# EAGLE design ShutterControl (EAGLE 5.11)
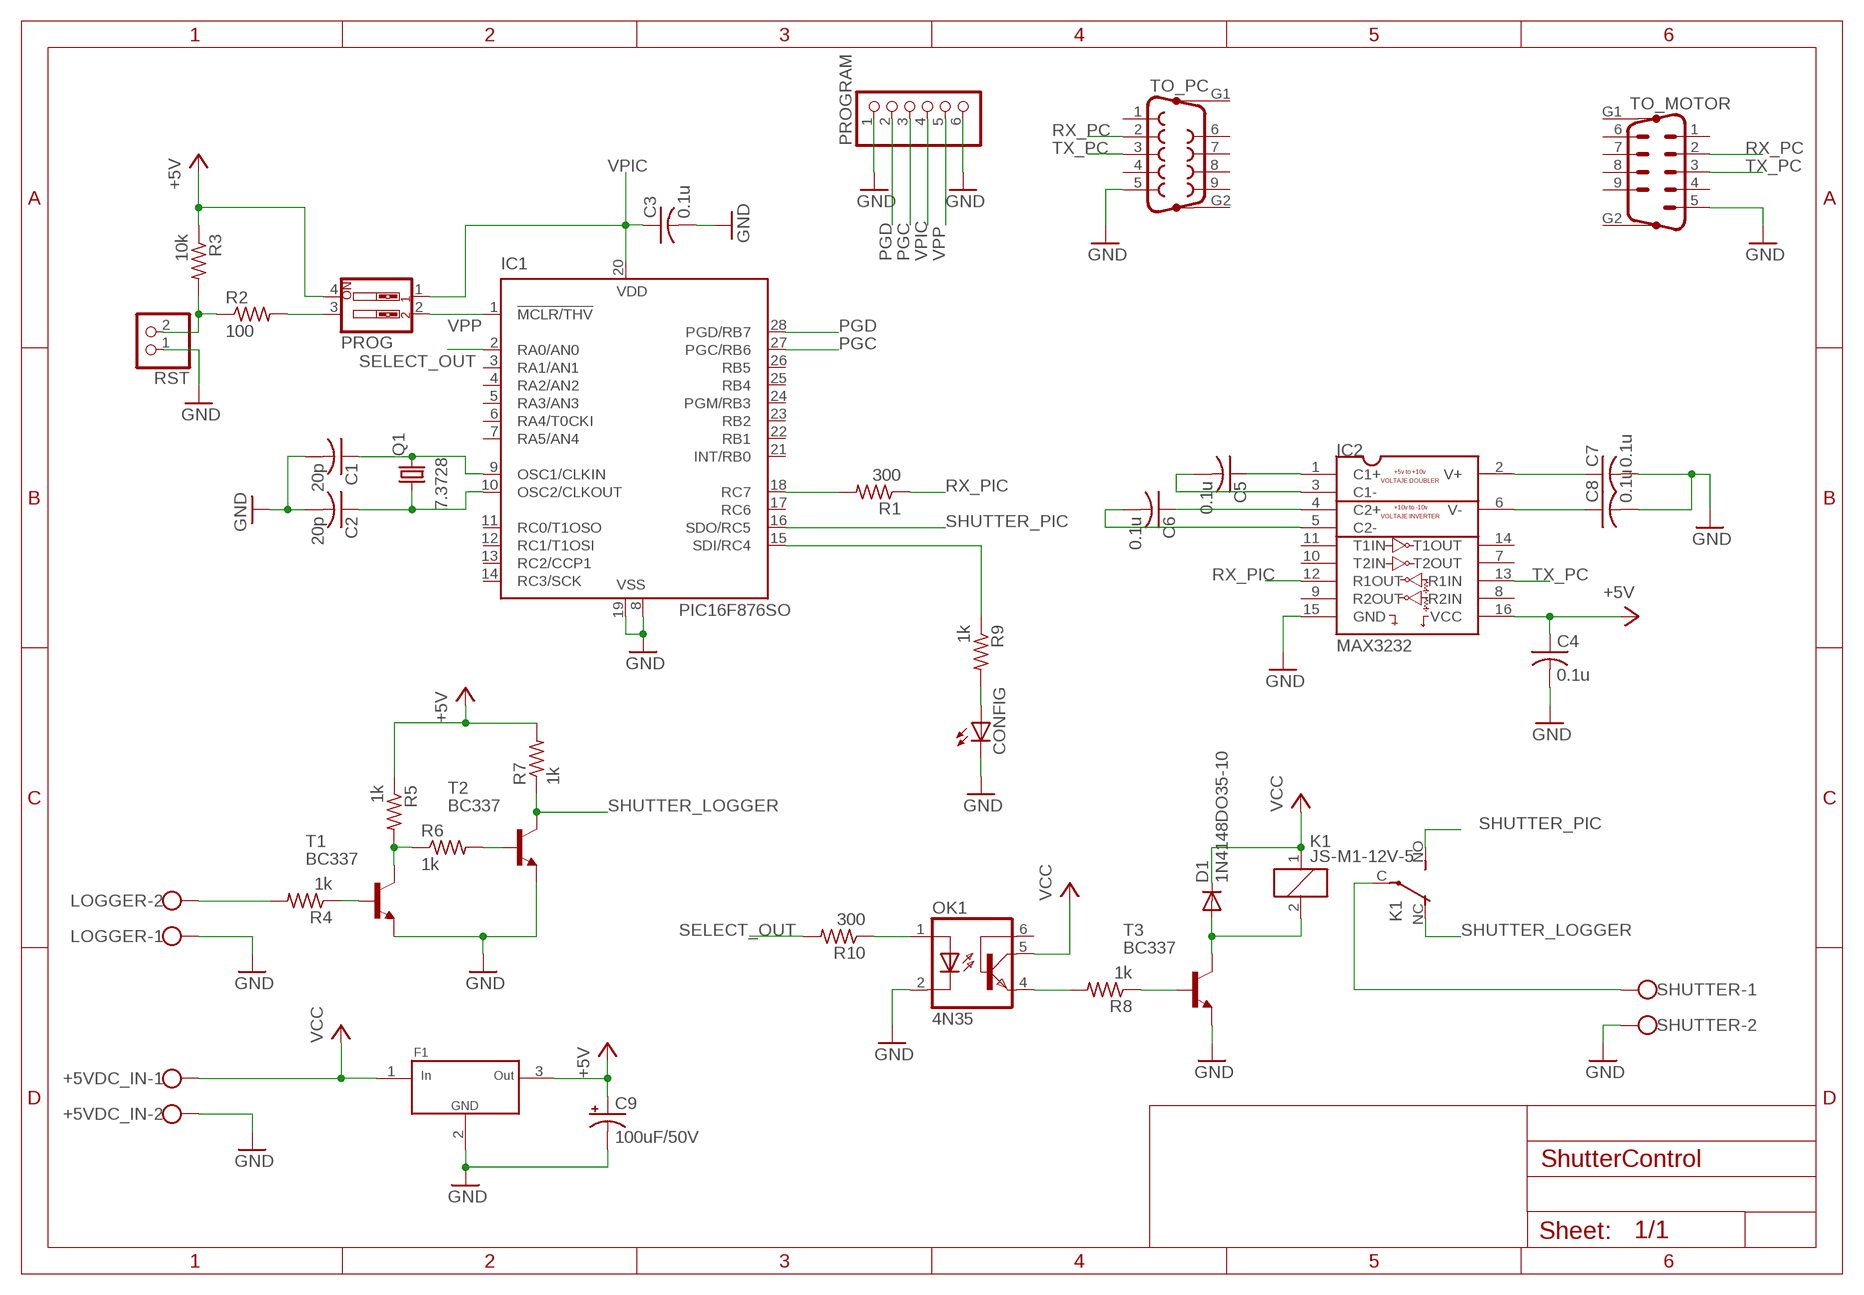
[diagram p0: schematic, sheet 1]

## Parts
+5VDC_IN  W237-102  [W237-102]
C1  20p  C-USC0603  [C0603]
C2  20p  C-USC0603  [C0603]
C3  0.1u  C-USC0603  [C0603]
C4  0.1u  C-USC0603  [C0603]
C5  0.1u  C-USC0603  [C0603]
C6  0.1u  C-USC0603  [C0603]
C7  0.1u  C-USC0603  [C0603]
C8  0.1u  C-USC0603  [C0603]
C9  100uF/50V  CPOL-USE3.5-8  [E3,5-8]
CONFIG  LED3MM  [LED3MM]
D1  1N4148DO35-10  [DO35-10]
F1  EMIFIL  [NFE-2706]
IC1  PIC16F876SO  [SO28W]
IC2  MAX3232  MAX3232IDR  [SO16]
K1  JS-M1-12V-5  [JS-M]
LOGGER  W237-102  [W237-102]
OK1  4N35  [DIL06]
PROG  SW_DIP-2  [EDG-02]
PROGRAM  PINHD-1X6  [1X06]
Q1  7.3728  CRYSTALHC49U70  [HC49U70]
R1  300  R-US_R0603  [R0603]
R2  100  R-US_R0603  [R0603]
R3  10k  R-US_R0603  [R0603]
R4  1k  R-US_R0603  [R0603]
R5  1k  R-US_R0603  [R0603]
R6  1k  R-US_R0603  [R0603]
R7  1k  R-US_R0603  [R0603]
R8  1k  R-US_R0603  [R0603]
R9  1k  R-US_R0603  [R0603]
R10  300  R-US_R0603  [R0603]
RST  PINHD-1X2  [1X02]
SHUTTER  W237-102  [W237-102]
T1  BC337  [TO92]
T2  BC337  [TO92]
T3  BC337  [TO92]
TO_MOTOR  M09HP  [M09HP]
TO_PC  F09HP  [F09HP]

## Nets
+5V: C4.1 C9.+ F1.3 IC2.16(VCC) PROG.4 R3.1 R5.1 R7.2
GND: +5VDC_IN.2 C1.2 C2.2 C3.2 C4.2 C7.2 C8.2 C9.- CONFIG.K(C) F1.2 IC1.8(VSS) IC1.19(VSS) IC2.15(GND) LOGGER.1 OK1.2(C) PROGRAM.1 PROGRAM.6 RST.1 SHUTTER.2 T1.1(E) T2.1(E) T3.1(E) TO_MOTOR.5 TO_PC.5
N$1: C1.1 IC1.9(OSC1/CLKIN) Q1.2
N$2: C2.1 IC1.10(OSC2/CLKOUT) Q1.1
N$3: C7.1 IC2.2(V+)
N$4: R2.1 R3.2 RST.2
N$5: PROG.3 R2.2
N$6: C8.1 IC2.6(V-)
N$7: C5.1 IC2.1(C1+)
N$8: C5.2 IC2.3(C1-)
N$9: C6.1 IC2.4(C2+)
N$10: C6.2 IC2.5(C2-)
N$11: R5.2 R6.1 T1.3(C)
N$12: R6.2 T2.2(B)
N$13: IC1.18(RC7) R1.2
N$14: CONFIG.A R9.2
N$15: R4.1 T1.2(B)
N$16: OK1.4(EMI) R8.2
N$17: D1.A K1.2 T3.3(C)
N$18: OK1.1(A) R10.1
N$19: R8.1 T3.2(B)
N$20: K1.C(2:P) SHUTTER.1
N$25: LOGGER.2 R4.2
N$26: IC1.15(SDI/RC4) R9.1
PGC: IC1.27(PGC/RB6) PROGRAM.3
PGD: IC1.28(PGD/RB7) PROGRAM.2
RX_PC: TO_MOTOR.2 TO_PC.2
RX_PIC: IC2.12(R1OUT) R1.1
SELECT_OUT: IC1.2(RA0/AN0) R10.2
SHUTTER_LOGGER: K1.NC(2:O) R7.1 T2.3(C)
SHUTTER_PIC: IC1.16(SDO/RC5) K1.NO(2:S)
TX_PC: IC2.13(R1IN) TO_MOTOR.3 TO_PC.3
VCC: +5VDC_IN.1 D1.C F1.1 K1.1 OK1.5(COL)
VPIC: C3.1 IC1.20(VDD) PROG.1 PROGRAM.4
VPP: IC1.1(!MCLR/THV) PROG.2 PROGRAM.5
Unconnected: IC1.3(RA1/AN1) IC1.4(RA2/AN2) IC1.5(RA3/AN3) IC1.6(RA4/T0CKI) IC1.7(RA5/AN4) IC1.11(RC0/T1OSO) IC1.12(RC1/T1OSI) IC1.13(RC2/CCP1) IC1.14(RC3/SCK) IC1.17(RC6) IC1.21(INT/RB0) IC1.22(RB1) IC1.23(RB2) IC1.24(PGM/RB3) IC1.25(RB4) IC1.26(RB5) IC2.7(T2OUT) IC2.8(R2IN) IC2.9(R2OUT) IC2.10(T2IN) IC2.11(T1IN) IC2.14(T1OUT) OK1.6(BAS) TO_MOTOR.1 TO_MOTOR.4 TO_MOTOR.6 TO_MOTOR.7 TO_MOTOR.8 TO_MOTOR.9 TO_MOTOR.G1 TO_MOTOR.G2 TO_PC.1 TO_PC.4 TO_PC.6 TO_PC.7 TO_PC.8 TO_PC.9 TO_PC.G1 TO_PC.G2

## Library data of the parts
+5VDC_IN LOGGER SHUTTER = con-wago-500:W237-102: WAGO SCREW CLAMP; MPN: 237-102; OC_FARNELL: unknown; OC_NEWARK: 70K9898
C1-C8 = rcl:C-US: CAPACITOR, American symbol
C9 = rcl:CPOL-US: POLARIZED CAPACITOR, American symbol
CONFIG = led:LED: LED OSRAM: - CHIPLED LG R971, LG N971, LY N971, LG Q971, LY Q971, LO R971, LY R971 LH N974, LH R974 LS Q976, LO Q976, LY Q976 LO Q996 - Hyper CHIPLED LW Q18S LB Q993, LB Q99A, LB R99A - SideLED LS A670, LO A670, LY A670, LG A670, LP A670 LB A673, LV A673, LT A673, LW A673 LH A674 LY A675 LS A676, LA A676, LO A676, LY A676, LW A676 LS A679, LY A679, LG A679 - Hyper Micro SIDELED® LS Y876, LA Y876, LO Y876, LY Y876 LT Y87S - SmartLED LW L88C, LW L88S LB L89C, LB L89S, LG L890 LS L89K, LO L89K, LY L89K LS L896, LA L896, LO L896, LY L896 - TOPLED LS T670, LO T670, LY T670, LG T670, LP T670 LSG T670, LSP T670, LSY T670, LOP T670, LYG T670 LG T671, LOG T671, LSG T671 LB T673, LV T673, LT T673, LW T673 LH T674 LS T676, LA T676, LO T676, LY T676, LB T676, LH T676, LSB T676, LW T676 LB T67C, LV T67C, LT T67C, LS T67K, LO T67K, LY T67K, LW E67C LS E67B, LA E67B, LO E67B, LY E67B, LB E67C, LV E67C, LT E67C LW T67C LS T679, LY T679, LG T679 LS T770, LO T770, LY T770, LG T770, LP T770 LB T773, LV T773, LT T773, LW T773 LH T774 LS E675, LA E675, LY E675, LS T675 LS T776, LA T776, LO T776, LY T776, LB T776 LHGB T686 LT T68C, LB T68C - Hyper Mini TOPLED® LB M676 - Mini TOPLED Santana® LG M470 LS M47K, LO M47K, LY M47K Source: http://www.osram.convergy.de LUXEON: - LUMILED® LXK2-PW12-R00, LXK2-PW12-S00, LXK2-PW14-U00, LXK2-PW14-V00 LXK2-PM12-R00, LXK2-PM12-S00, LXK2-PM14-U00 LXK2-PE12-Q00, LXK2-PE12-R00, LXK2-PE12-S00, LXK2-PE14-T00, LXK2-PE14-U00 LXK2-PB12-K00, LXK2-PB12-L00, LXK2-PB12-M00, LXK2-PB14-N00, LXK2-PB14-P00, LXK2-PB14-Q00 LXK2-PR12-L00, LXK2-PR12-M00, LXK2-PR14-Q00, LXK2-PR14-R00 LXK2-PD12-Q00, LXK2-PD12-R00, LXK2-PD12-S00 LXK2-PH12-R00, LXK2-PH12-S00 LXK2-PL12-P00, LXK2-PL12-Q00, LXK2-PL12-R00 Source: www.luxeon.com KINGBRIGHT: KA-3528ASYC Source: www.kingbright.com
D1 = diode:1N4148: DIODE high speed (Philips)
F1 = magnetometro:EMIFIL
IC1 = microchip:PIC16*876: MICROCONTROLLER flash type; MF: MICROCHIP; MPN: PIC16F876-20/SO; OC_FARNELL: 9761268; OC_NEWARK: 12C1950
IC2 = LibraryMagnet:MAX3232IDR
K1 = relay:JS-M1*: Automotive Ultra-Miniature Power Relay NAiS Source: http://www.mew-europe.com/.. en_ds_61211_0000.pdf; MF: FARNELL; MPN: JSM1-12V-5; OC_FARNELL: 910351; OC_NEWARK: 14J1764
OK1 = optocoupler:4N35: MOTOROLA OPTO COUPLER; MF: FAIRCHILD SEMICONDUCTOR; MPN: 4N35; OC_FARNELL: 1328375; OC_NEWARK: 72K9946
PROG = special:SW_DIP-2: DIP SWITCH
PROGRAM = pinhead:PINHD-1X6: PIN HEADER
Q1 = crystal:CRYSTAL: CRYSTAL; OC_FARNELL: unknown; OC_NEWARK: unknown
R1-R10 = rcl:R-US_: RESISTOR, American symbol
RST = pinhead:PINHD-1X2: PIN HEADER
T1-T3 = transistor:BC337: NPN TRANSISTOR
TO_MOTOR = con-subd:M09HP: SUB-D; OC_FARNELL: unknown; OC_NEWARK: unknown
TO_PC = con-subd:F09HP: SUB-D; OC_FARNELL: unknown; OC_NEWARK: unknown

## Board
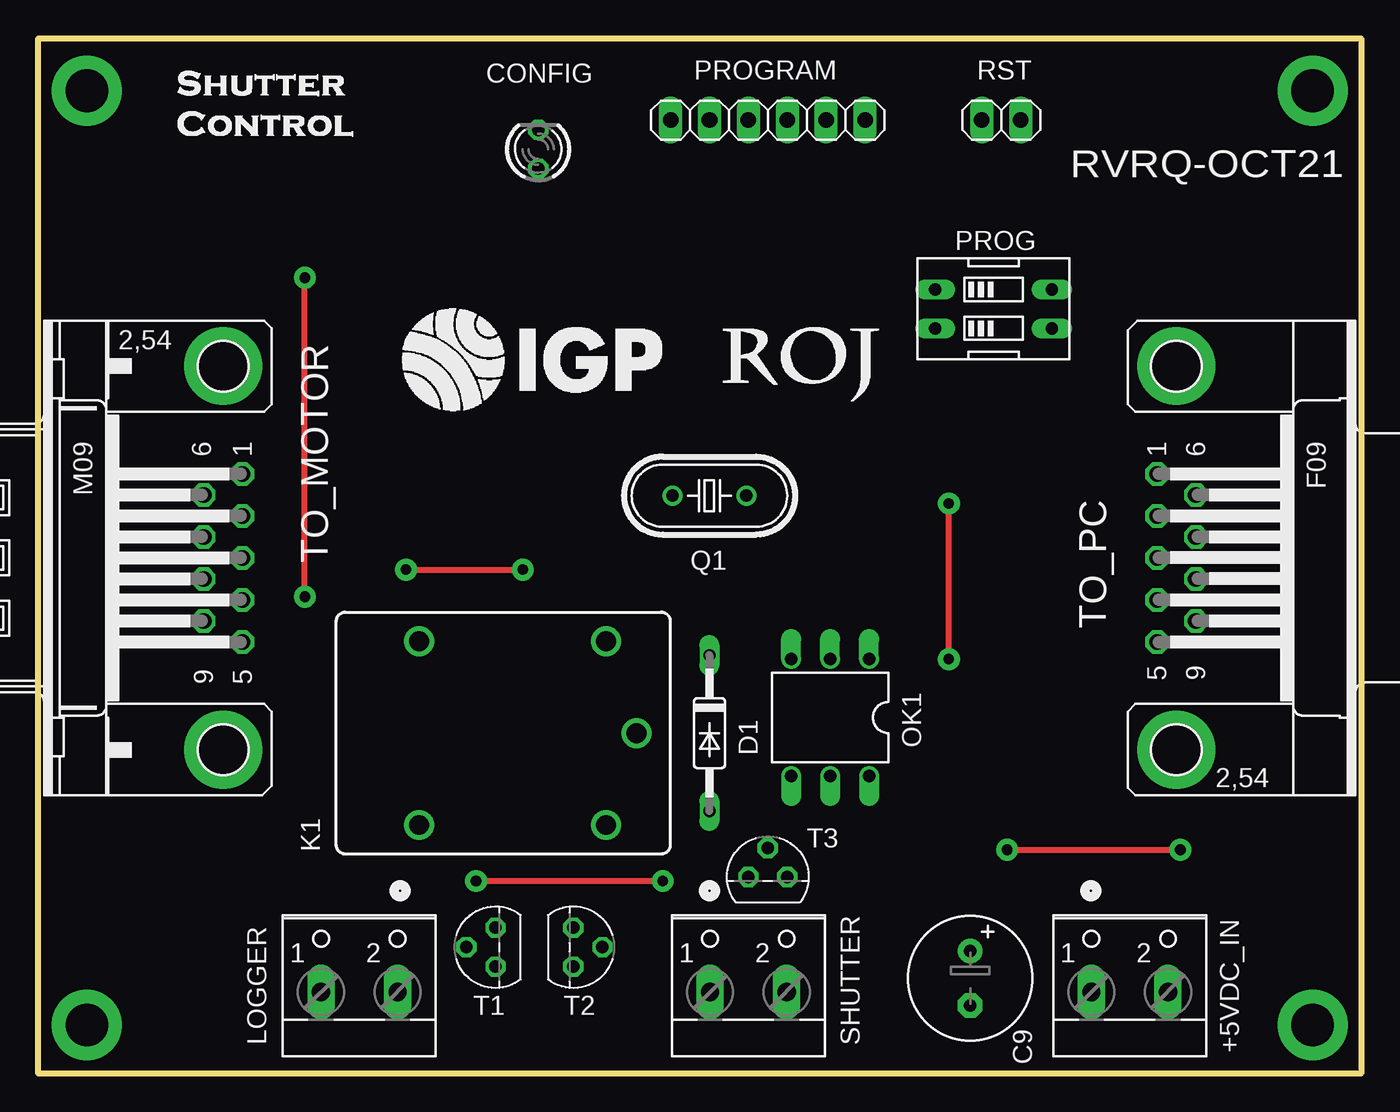
[diagram p1: board, top side]
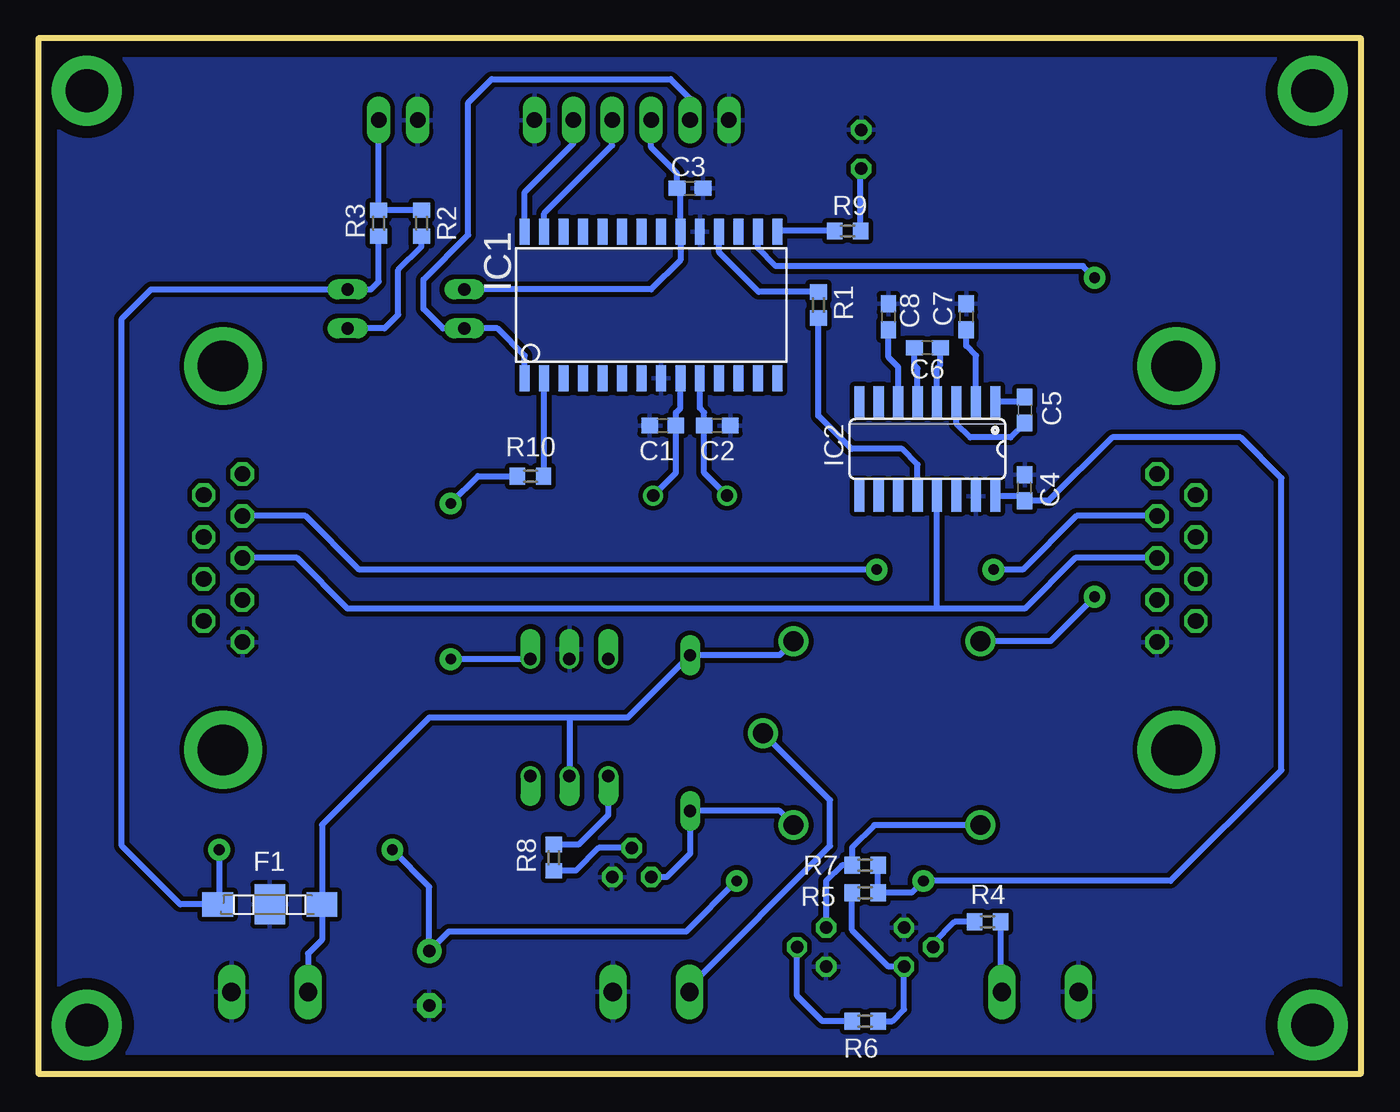
[diagram p2: board, bottom side, seen from below]

Size 86.36 x 67.56 mm. Coordinates in mm from the lower left corner, seen from the top.
Outline: 0,0 0,67.56 86.36,67.56 86.36,0 0,0
Copper layers (1*16): Top 0.035mm / dielectric 1.5mm / Bottom 0.035mm
Design rules "default": minimum track width 10mil, minimum drill 24mil, track to track 8mil, track to pad 8mil, pad to pad 8mil, via to via 8mil, smd to smd 8mil, copper to edge 40mil, drill to drill 8mil, minimum pad ring 10mil, minimum via ring 8mil, stop-mask expansion 4mil, vias tented up to drill 0mil, thermal gap 10mil
bRestrict: area 0.6,61.6 to 5.7,66.7; area 0.6,0.6 to 5.7,5.7; area 80.6,0.6 to 85.7,5.7; area 80.6,61.6 to 85.7,66.7

### Footprints (pad centres in the part's own frame; a part is rotated, then mirrored left to right if it is on the bottom)
W237-102 = drill 1.194 long: 1 -2.5,-0.381; 2 2.5,-0.381
C0603 = smd 1.1 x 1: 1 -0.85,0; 2 0.85,0
E3,5-8 = drill 0.813 pad 1.6 round: + -1.778,0 | drill 0.813 pad 1.6 octagon: - 1.778,0
LED3MM = drill 0.813 octagon: A -1.27,0; K 1.27,0
DO35-10 = drill 0.813 long: A 5.08,0; C -5.08,0
NFE-2706 = smd 2 x 1.6: 1 -3.4,0; 3 3.4,0 | smd 2 x 2.6: 2 0,0
SO28W = smd 0.65 x 1.7: 1 -8.255,-4.78; 2 -6.985,-4.78; 3 -5.715,-4.78; 4 -4.445,-4.78; 5 -3.175,-4.78; 6 -1.905,-4.78; 7 -0.635,-4.78; 8 0.635,-4.78; 9 1.905,-4.78; 10 3.175,-4.78; 11 4.445,-4.78; 12 5.715,-4.78; 13 6.985,-4.78; 14 8.255,-4.78; 15 8.255,4.78; 16 6.985,4.78; 17 5.715,4.78; 18 4.445,4.78; 19 3.175,4.78; 20 1.905,4.78; 21 0.635,4.78; 22 -0.635,4.78; 23 -1.905,4.78; 24 -3.175,4.78; 25 -4.445,4.78; 26 -5.715,4.78; 27 -6.985,4.78; 28 -8.255,4.78
SO16 = smd 0.66 x 2.032: 1 -4.445,-3.073; 2 -3.175,-3.073; 3 -1.905,-3.073; 4 -0.635,-3.073; 5 0.635,-3.073; 6 1.905,-3.073; 7 3.175,-3.073; 8 4.445,-3.073; 9 4.445,3.073; 10 3.175,3.073; 11 1.905,3.073; 12 0.635,3.073; 13 -0.635,3.073; 14 -1.905,3.073; 15 -3.175,3.073; 16 -4.445,3.073
JS-M = drill 1.3 round: 1 6.7,6; 2 6.7,-6; C 8.7,0; NC -5.5,-6; NO -5.5,6
DIL06 = drill 0.813 offset: 1 -2.54,-3.81; 2 0,-3.81; 3 2.54,-3.81; 4 2.54,3.81; 5 0,3.81; 6 -2.54,3.81
EDG-02 = drill 0.813 long: 1 -1.27,-3.81; 2 1.27,-3.81; 3 1.27,3.81; 4 -1.27,3.81
1X06 = drill 1.016 long: 1 -6.35,0; 2 -3.81,0; 3 -1.27,0; 4 1.27,0; 5 3.81,0; 6 6.35,0
HC49U70 = drill 0.813 round: 1 -2.413,0; 2 2.413,0
R0603 = smd 1 x 1.1: 1 -0.85,0; 2 0.85,0
1X02 = drill 1.016 long: 1 -1.27,0; 2 1.27,0
TO92 = drill 0.813 octagon: 1 1.27,0; 2 0,1.905; 3 -1.27,0
M09HP = drill 1.016 octagon: 1 -5.486,1.27; 2 -2.743,1.27; 3 0,1.27; 4 2.743,1.27; 5 5.486,1.27; 6 -4.115,-1.27; 7 -1.372,-1.27; 8 1.372,-1.27; 9 4.115,-1.27 | drill 3.302 pad 5.08 round: G1 -12.522,0; G2 12.522,0
F09HP = drill 1.016 octagon: 1 -5.486,-1.27; 2 -2.743,-1.27; 3 0,-1.27; 4 2.743,-1.27; 5 5.486,-1.27; 6 -4.115,1.27; 7 -1.372,1.27; 8 1.372,1.27; 9 4.115,1.27 | drill 3.302 pad 5.08 round: G1 -12.522,0; G2 12.522,0

### Placement (x,y rotation side)
+5VDC_IN  71.25,5.71 0 top
C1  45.59,42.29 180 bottom
C2  42.04,42.29 0 bottom
C3  43.82,57.79 0 bottom
C4  21.97,38.23 90 bottom
C5  21.97,43.31 270 bottom
C6  28.32,47.37 180 bottom
C7  25.78,49.4 90 bottom
C8  30.86,49.4 90 bottom
C9  60.83,6.22 270 top
CONFIG  32.64,60.33 90 top
D1  43.82,22.22 270 top
F1  71.25,11.05 180 bottom
IC1  46.36,50.16 0 bottom
IC2  28.32,40.77 180 bottom
K1  30.35,22.22 0 top
LOGGER  20.95,5.71 0 top
OK1  51.69,23.24 180 top
PROG  62.36,49.91 270 top
PROGRAM  47.62,62.23 180 top
Q1  43.82,37.72 0 top
R1  35.43,50.16 90 bottom
R2  61.34,55.5 270 bottom
R3  64.13,55.5 90 bottom
R4  24.38,9.91 0 bottom
R5  32.39,11.81 180 bottom
R6  32.39,3.43 180 bottom
R7  32.39,13.59 0 bottom
R8  52.71,14.1 90 bottom
R9  33.53,54.99 0 bottom
R10  54.23,38.99 0 bottom
RST  62.87,62.23 0 top
SHUTTER  46.36,5.71 0 top
T1  29.84,8.26 90 top
T2  34.93,8.26 270 top
T3  47.62,12.83 0 top
TO_MOTOR  12.06,33.66 270 top
TO_PC  74.3,33.66 270 top

### Tracks (layer width: path | path; a pad name or v marks a point on that pad's centre or on a via)
+5V  (via drill 0.7 pad 1.42)
  Top 0.406: v28.57,12.57 v40.77,12.57 | v63.25,14.61 v74.55,14.61
  Bottom 0.406: R7.2 R5.1 29.34,11.81 v28.57,12.57 12.45,12.57 5.21,19.81 5.21,38.86 7.87,41.53 16.26,41.53 20.41,37.38 C4.1 22.29,37.69 IC2.16 | v40.77,12.57 44.07,9.27 59.56,9.27 C9.+ 60.83,12.19 v63.25,14.61 | R3.1 64.13,51.69 64.64,51.18 PROG.4 78.99,51.18 80.9,49.28 80.9,14.86 77.09,11.05 F1.3 74.55,11.15 v74.55,14.61
GND
  pour Bottom (isolate 0.305): 0,67.56 87.5,67.56 87.5,-0.25 0,-0.25
N$1
  Bottom 0.406: IC1.9 44.45,43.43 44.74,43.14 C1.1 44.74,39.2 Q1.2
N$2
  Bottom 0.406: IC1.10 43.18,43.43 42.89,43.14 C2.1 42.89,39.2 Q1.1
N$3
  Bottom 0.406: IC2.2 25.15,46.86 25.78,47.5 C7.1
N$4
  Bottom 0.406: RST.2 R3.2 R2.1
N$5
  Bottom 0.406: PROG.3 63.75,48.64 62.87,49.53 62.87,52.45 61.34,53.98 R2.2
N$6
  Bottom 0.406: IC2.6 30.23,46.1 30.86,46.74 C8.1
N$7
  Bottom 0.406: C5.1 22.29,43.84 IC2.1
N$8
  Bottom 0.406: C5.2 22.9,41.53 25.53,41.53 26.42,42.42 IC2.3
N$9
  Bottom 0.406: IC2.4 27.69,46.02 27.47,46.24 C6.1
N$10
  Bottom 0.406: IC2.5 28.96,46.02 29.17,46.24 C6.2
N$11
  Bottom 0.406: R6.1 30.61,3.43 29.84,4.19 T1.3 30.86,6.99 33.23,9.36 R5.2
N$12
  Bottom 0.406: R6.2 35.18,3.43 36.83,5.08 T2.2
N$13
  Bottom 0.406: R1.2 39.33,51.02 41.91,53.59 IC1.18
N$14
  Bottom 0.406: R9.2 32.68,59.02 CONFIG.A
N$15
  Bottom 0.406: R4.1 26.54,9.91 27.94,8.51 T1.2
N$16
  Bottom 0.406: OK1.4 49.15,16.89 51.09,14.95 R8.2
N$17
  Bottom 0.406: T3.3 45.34,12.83 43.82,14.35 D1.A 37.97,17.14 K1.2
N$18  (via drill 0.7 pad 1.42)
  Top 0.406: v59.44,27.05 v59.44,37.21
  Bottom 0.406: R10.1 57.66,38.99 v59.44,37.21 | OK1.1 v59.44,27.05
N$19
  Bottom 0.406: T3.2 49.78,14.73 51.27,13.25 R8.1
N$20
  Bottom 0.406: K1.C 34.67,17.84 34.67,14.86 43.86,5.67 SHUTTER.1
N$21  (via drill 2.8 pad 4.57)
  other vias: 3.17,64.13
N$22  (via drill 2.8 pad 4.57)
  other vias: 83.18,64.13
N$23  (via drill 2.8 pad 4.57)
  other vias: 83.18,3.17
N$24  (via drill 2.8 pad 4.57)
  other vias: 3.17,3.17
N$25
  Bottom 0.406: LOGGER.2 23.53,5.41 R4.2
N$26
  Bottom 0.406: R9.1 38.05,54.99 IC1.15
PGC
  Bottom 0.406: IC1.27 53.34,56.13 48.9,60.58 PROGRAM.3
PGD
  Bottom 0.406: IC1.28 54.61,57.53 51.44,60.71 PROGRAM.2
RX_PC  (via drill 0.7 pad 1.42)
  Top 0.406: v24,32.89 v31.62,32.89
  Bottom 0.406: v31.62,32.89 65.41,32.89 68.91,36.4 TO_PC.2 | TO_MOTOR.2 18.59,36.4 22.1,32.89 v24,32.89
RX_PIC
  Bottom 0.406: IC2.12 28.96,39.75 29.97,40.77 33.27,40.77 35.43,42.93 R1.1
SELECT_OUT
  Bottom 0.406: IC1.2 53.34,38.99 R10.2
SHUTTER_LOGGER
  Bottom 0.406: T2.3 34.93,12.57 33.91,13.59 R7.1 33.23,14.77 31.78,16.22 K1.NC
SHUTTER_PIC  (via drill 0.7 pad 1.42)
  Top 0.406: v17.4,31.11 v17.4,51.94
  Bottom 0.406: K1.NO 20.29,28.22 v17.4,31.11 | v17.4,51.94 18.16,52.71 38.23,52.71 39.37,53.85 IC1.16
TX_PC
  Bottom 0.406: TO_PC.3 69.47,33.66 66.17,30.35 27.69,30.35 | 27.69,30.35 IC2.13 | TO_MOTOR.3 18.67,33.66 21.97,30.35 27.69,30.35
VCC
  Bottom 0.406: 51.69,23.24 47.88,23.24 D1.C 37.97,27.3 K1.1 | 51.69,23.24 60.83,23.24 67.85,16.23 F1.1 67.85,8.73 68.75,7.83 +5VDC_IN.1 | 51.69,23.24 OK1.5
VPIC
  Bottom 0.406: PROG.1 46.36,51.18 44.45,53.09 IC1.20 44.45,57.57 C3.1 44.66,58.76 46.36,60.45 PROGRAM.4
VPP
  Bottom 0.406: IC1.1 54.61,46.86 56.39,48.64 PROG.2 59.94,48.64 61.21,49.91 61.21,51.82 58.29,54.74 58.29,63.37 56.77,64.9 45.09,64.9 43.82,63.63 PROGRAM.5

### Text on the board
tPlace: RVRQ-OCT21